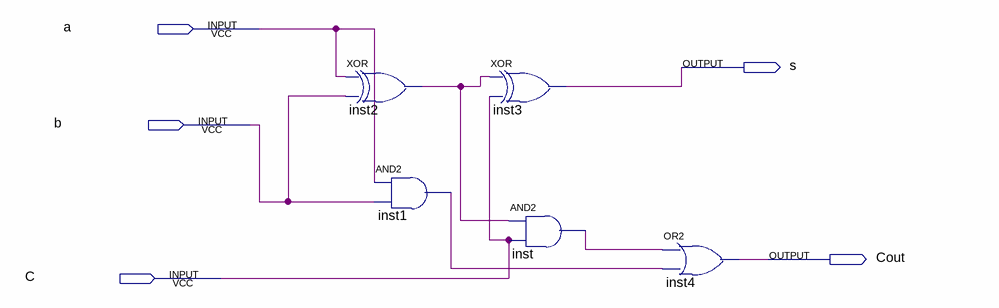
[diagram p0: schematic sheet]
// Quartus schematic fullAdder.bdf as structural Verilog: 5 symbols, 5 pins
module fullAdder (
  input  a,
  input  b,
  input  C,
  output s,
  output Cout
);

  wire inst1_out, inst2_out, inst_out;

  xor inst2 (inst2_out, a, b);
  and inst1 (inst1_out, a, b);
  xor inst3 (s, inst2_out, C);
  and inst (inst_out, inst2_out, C);
  or inst4 (Cout, inst_out, inst1_out);
endmodule
